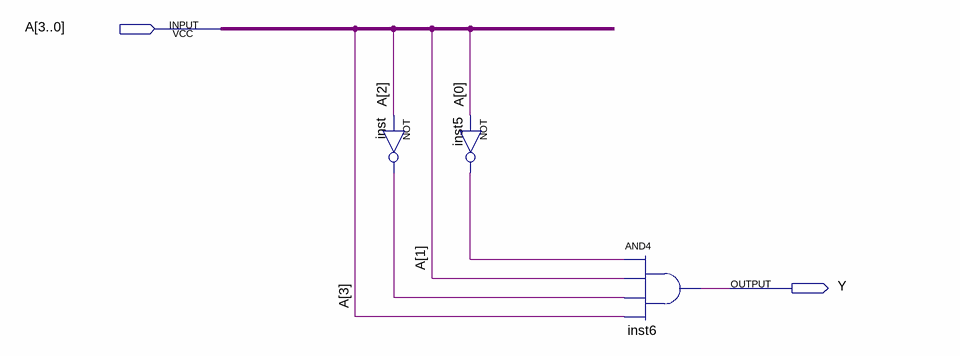
[diagram p0: schematic sheet]
// Quartus schematic check_9.bdf as structural Verilog: 3 symbols, 2 pins
module check_9 (
  input  [3:0] A,
  output Y
);

  wire inst5_out, inst_out;

  not inst (inst_out, A[2]);
  not inst5 (inst5_out, A[0]);
  and inst6 (Y, inst5_out, A[1], inst_out, A[3]);
endmodule
